# EAGLE design 14DoF LSM9DS1 ADXL375 (EAGLE 7.3.0)
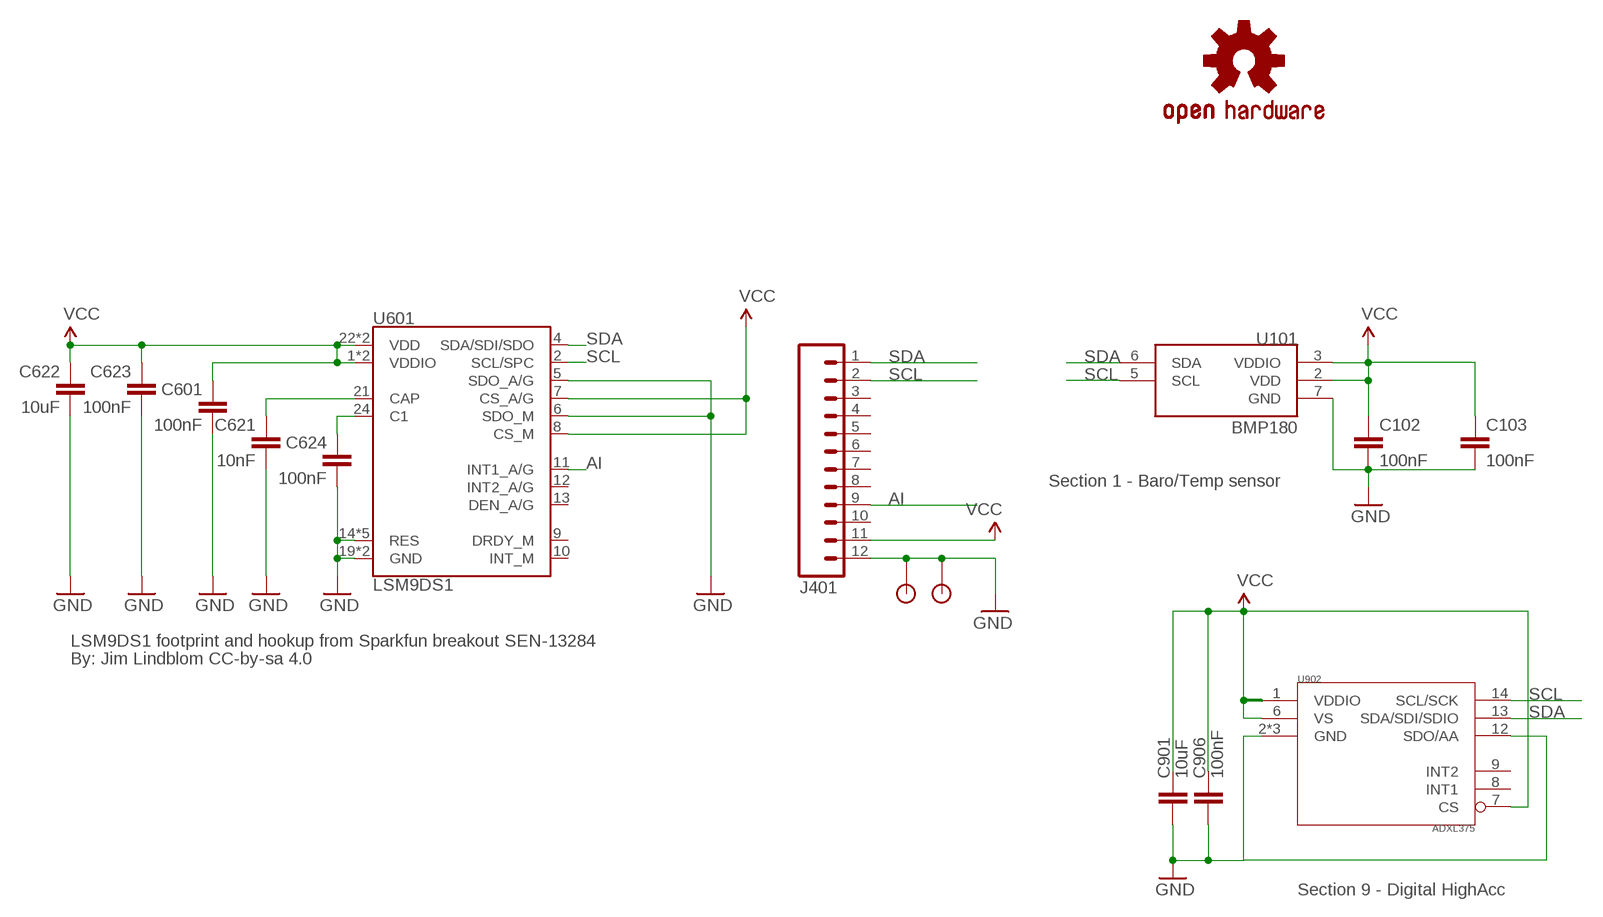
[diagram p0: schematic, sheet 1]

## Parts
C102  100nF  CAP0603-CAP  [0603-CAP]
C103  100nF  CAP0603-CAP  [0603-CAP]
C601  100nF  0.1UF-25V(+80/-20%)(0603)  [0603-CAP]
C621  10nF  10NF/10000PF-50V-10%(0603)  [0603-CAP]
C622  10uF  10UF-6.3V-20%(0603)  [0603-CAP]
C623  100nF  0.1UF-25V(+80/-20%)(0603)  [0603-CAP]
C624  100nF  0.1UF-25V(+80/-20%)(0603)  [0603-CAP]
C901  10uF  CAP0603-CAP  [0603-CAP]
C906  100nF  CAP0603-CAP  [0603-CAP]
J401  M12PTH  [1X12]
U101  BMP180  [BMP180]
U601  LSM9DS1  [LGA24-8X4]
U902  ADXL375  [ADXL375]
U$2  OSHW-LOGOS  [OSHW-LOGO-S]
U$4  STANDOFF  [STANDOFF]
U$5  STANDOFF  [STANDOFF]

## Nets
AI: J401.9 U601.11(INT1_A/G)
C1: C624.1 U601.24(C1)
CAP: C621.1 U601.21(CAP)
GND: C102.2 C103.2 C601.2 C621.2 C622.2 C623.2 C624.2 C901.2 C906.2 J401.12 U101.7(GND) U601.5(SDO_A/G) U601.6(SDO_M) U601.14(RES) U601.15(RES) U601.16(RES) U601.17(RES) U601.18(RES) U601.19(GND) U601.20(GND) U902.2(GND) U902.4(GND) U902.5(GND) U902.12(SDO/AA) U$4.P$1 U$5.P$1
SCL: J401.2 U101.5(SCL) U601.2(SCL/SPC) U902.14(SCL/SCK)
SDA: J401.1 U101.6(SDA) U601.4(SDA/SDI/SDO) U902.13(SDA/SDI/SDIO)
VCC [POWER]: C102.1 C103.1 C601.1 C622.1 C623.1 C901.1 C906.1 J401.11 U101.2(VDD) U101.3(VDDIO) U601.1(VDDIO) U601.3(VDDIO) U601.7(CS_A/G) U601.8(CS_M) U601.22(VDD) U601.23(VDD) U902.1(VDDIO) U902.6(VS)
Unconnected: J401.3 J401.4 J401.5 J401.6 J401.7 J401.8 J401.10 U601.9(DRDY_M) U601.10(INT_M) U601.12(INT2_A/G) U601.13(DEN_A/G) U902.7(CS) U902.8(INT1) U902.9(INT2)

## Notes on the sheet
- Section 1 - Baro/Temp sensor
- LSM9DS1 footprint and hookup from Sparkfun breakout SEN-13284
- By: Jim Lindblom CC-by-sa 4.0
- Section 9 - Digital HighAcc

## Library data of the parts
C102 C103 C906 = SparkFun:CAP: Capacitor Standard 0603 ceramic capacitor, and 0.1" leaded capacitor.; DIGIKEY: 445-1317-2-ND
C601 C623 C624 = SparkFun-Capacitors:0.1UF-25V(+80/-20%)(0603): CAP-00810 Ceramic Standard decoupling cap; PROD_ID: CAP-00810; VALUE: 0.1uF
C621 = SparkFun-Capacitors:10NF/10000PF-50V-10%(0603): CAP-00867; PROD_ID: CAP-00867
C622 = SparkFun-Capacitors:10UF-6.3V-20%(0603): CAP-11015; PROD_ID: CAP-11015
C901 = SparkFun:CAP: Capacitor Standard 0603 ceramic capacitor, and 0.1" leaded capacitor.; DIGIKEY: 445-7486-1-ND
J401 = SparkFun:M12: Header 12 Standard 12-pin 0.1" header. Use with straight break away headers (SKU : PRT-00116), right angle break away headers (PRT-00553), swiss pins (PRT-00743), machine pins (PRT-00117), and female headers (PRT-00115).; DIGIKEY: $NOPART
U101 = KwanSystems:BMP180; DIGIKEY: 828-1027-1-ND
U601 = LSM9DS1_temp:LSM9DS1: LSM9DS1 3D accelerometer, gyroscope & magnetometer The LSM9DS1 is a system-in-package featuring a 3D digital linear acceleration sensor, a 3D digital angular rate sensor, and a 3D digital magnetic sensor. The LSM9DS1 has a linear acceleration full scale of ±2g/±4g/±8/±16 g, a magnetic field full scale of ±4/±8/±12/±16 gauss and an angular rate of ±245/±500/±2000 dps. The LSM9DS1 includes an I2 C serial bus interface supporting standard and fast mode (100 kHz and 400 kHz) and an SPI serial standard interface. Magnetic, accelerometer and gyroscope sensing can be enabled or set in power-down mode separately for smart power management. The LSM9DS1 is available in a plastic land grid array package (LGA) and it is guaranteed to operate over an extended temperature range from -40 °C to +85 °C.; PROD_ID: IC-12536
U902 = KwanSystems:ADXL375
U$2 = SparkFun:OSHW-LOGO: Open Source Hardware Logo This logo indicates the piece of hardware it is found on incorporates a OSHW license and/or adheres to the definition of open source hardware found here: http://freedomdefined.org/OSHW; DIGIKEY: $NOPART
U$4 U$5 = KwanSystems:STANDOFF

## Net classes
0 default: width 0.152 mm, drill 0.33 mm, clearance 0.152 mm
1 POWER: width 0.152 mm, drill 0.33 mm, clearance 0.152 mm
2 hv: width 0.152 mm, drill 0.33 mm, clearance 0.152 mm

## Board
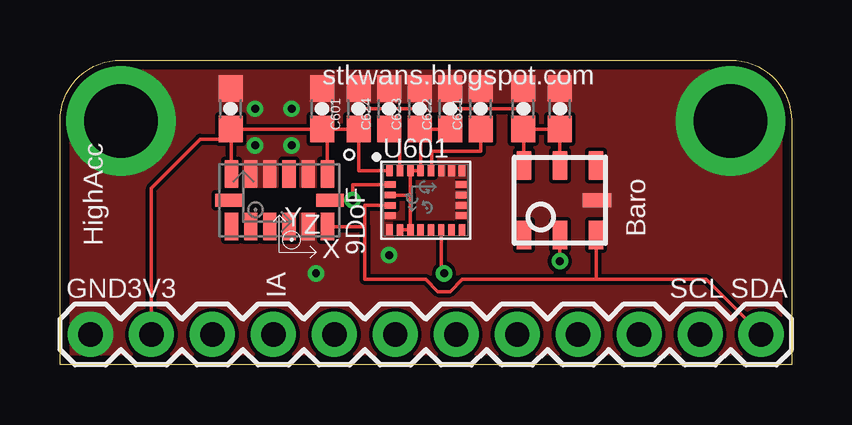
[diagram p1: board, top side]
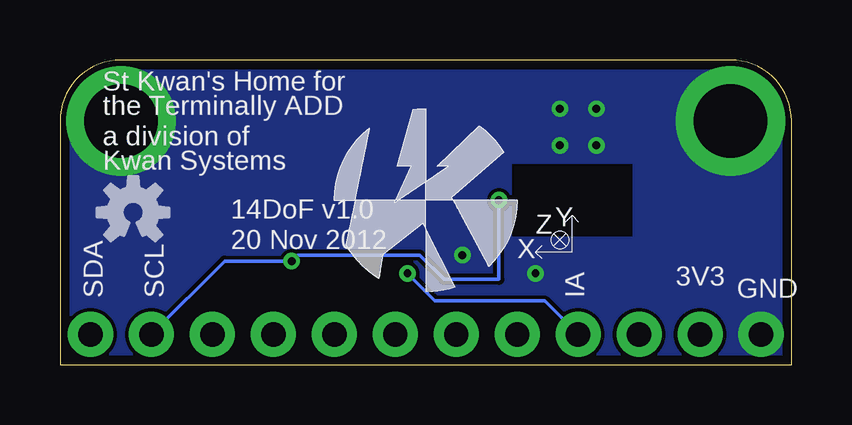
[diagram p2: board, bottom side, seen from below]

Size 30.48 x 12.7 mm. Coordinates in mm from the lower left corner, seen from the top.
Outline: 0,0 0,10.16 arc-90 2.54,12.7 27.94,12.7 arc-90 30.48,10.16 30.48,0 0,0
Copper layers (1*16): Top 0.0356mm / dielectric 1.5011mm / Bottom 0.0356mm
Design rules "default": minimum track width 6mil, minimum drill 13mil, track to track 6mil, track to pad 6mil, pad to pad 6mil, via to via 6mil, smd to smd 6mil, copper to edge 15mil, drill to drill 6mil, minimum pad ring 7mil, minimum via ring 7mil, stop-mask expansion 4mil, vias tented up to drill 14mil, thermal gap 10mil
vRestrict: area 0.8,2.8 to 1.8,4.8; area 3.3,2.8 to 4.3,4.8; area 5.8,2.8 to 6.9,4.8; area 8.4,2.8 to 9.4,3.8; area 10.9,2.8 to 11.7,5.3; area 12.7,2.8 to 15.2,3.6; area 13.5,3.6 to 14.2,5.3; area 15.5,2.8 to 18,3.6; area 18.5,2.8 to 19.6,3.8; area 20.6,2.8 to 22.6,3.6; area 21.1,3.6 to 21.8,4.8; area 23.6,2.8 to 24.4,3.8; 19 more areas

### Footprints (pad centres in the part's own frame; a part is rotated, then mirrored left to right if it is on the bottom)
0603-CAP = smd 1.1 x 1: 1 -0.85,0; 2 0.85,0
1X12 = drill 1.016 pad 1.88: 1 0,0; 2 2.54,0; 3 5.08,0; 4 7.62,0; 5 10.16,0; 6 12.7,0; 7 15.24,0; 8 17.78,0; 9 20.32,0; 10 22.86,0; 11 25.4,0; 12 27.94,0
BMP180 = smd 0.6 x 1.2: 1 1.5,1.45; 2 0,1.45; 3 -1.5,1.45; 4 -1.5,-1.45; 5 0,-1.45; 6 1.5,-1.45 | smd 1.2 x 0.6: 7 1.55,0
LGA24-8X4 = smd 0.27 x 0.45: 1 -1.505,1.225; 6 -1.505,-1.225; 7 -1.075,-1.225; 8 -0.645,-1.225; 9 -0.215,-1.225; 10 0.215,-1.225; 11 0.645,-1.225; 12 1.075,-1.225; 13 1.505,-1.225; 18 1.505,1.225; 19 1.075,1.225; 20 0.645,1.225; 21 0.215,1.225; 22 -0.215,1.225; 23 -0.645,1.225; 24 -1.075,1.225 | smd 0.45 x 0.27: 2 -1.475,0.645; 3 -1.475,0.215; 4 -1.475,-0.215; 5 -1.475,-0.645; 14 1.475,-0.645; 15 1.475,-0.215; 16 1.475,0.215; 17 1.475,0.645
ADXL375 = smd 0.55 x 1.145: 1 2,1.097; 2 1.2,1.097; 3 0.4,1.097; 4 -0.4,1.097; 5 -1.2,1.097; 6 -2,1.097; 8 -2,-1.097; 9 -1.2,-1.097; 10 -0.4,-1.097; 11 0.4,-1.097; 12 1.2,-1.097; 13 2,-1.097 | smd 1.145 x 0.55: 7 -2.098,0; 14 2.098,0
STANDOFF = drill 3.048 pad 4.572: P$1 0,0

### Placement (x,y rotation side)
C102  20.83,10.67 90 top
C103  19.3,10.67 90 top
C601  12.45,10.67 90 top
C621  17.53,10.67 90 top
C622  16.26,10.67 90 top
C623  14.99,10.67 90 top
C624  13.72,10.67 90 top
C901  10.92,10.67 90 top
C906  7.11,10.67 90 top
J401  29.21,1.27 180 top
U101  20.83,6.86 0 top
U601  15.24,6.86 0 top
U902  9.14,6.86 0 top
U$1  [KWAN_ACC]  15.24,6.86 0 bottom
U$2  27.43,6.35 0 bottom
U$3  [AXES_SM]  9.14,4.7 0 top
U$4  2.54,10.16 0 top
U$5  27.94,10.16 0 top

### Tracks (layer width: path | path; a pad name or v marks a point on that pad's centre or on a via)
AI  (via drill 0.33)
  Top 0.152: U601.11 15.88,3.93 v16,3.81
  Bottom 0.152: J401.9 10.29,2.67 14.86,2.67 v16,3.81
C1
  Top 0.152: C624.1 14.16,9.37 U601.24
CAP
  Top 0.152: U601.21 15.49,8.13 15.49,8.89 17.53,8.89 C621.1
GND  (via drill 0.33)
  other vias: 13.72,4.57 10.67,3.81 8.13,9.14 8.13,10.67 9.65,9.14 9.65,10.67
  pour Top (no thermals): 0,0 0,10.16 arc-90 2.54,12.7 27.94,12.7 arc-90 30.48,10.16 30.48,0
  pour Bottom (no thermals): 0,0 0,10.16 arc-90 2.54,12.7 27.94,12.7 arc-90 30.48,10.16 30.48,0
SCL  (via drill 0.33)
  Top 0.152: U902.14 v12.19,6.86 12.19,7.5 U601.2 | v20.83,4.32 U101.5
  Bottom 0.152: J401.2 23.62,4.32 v20.83,4.32 20.57,4.57 15.49,4.57 14.48,3.56 12.19,3.56 v12.19,6.86
SDA
  Top 0.152: U902.13 12.7,5.76 | 12.7,5.76 12.7,6.64 U601.4 | 12.7,5.76 12.7,3.56 15.24,3.56 15.75,3.05 16.26,3.05 16.76,3.56 22.35,3.56 | 22.35,3.56 22.35,5.41 U101.6 | 22.35,3.56 26.92,3.56 J401.1
VCC
  Top 0.152: C623.1 C622.1 16.26,10.67 19.3,10.67 C103.1 | C623.1 15.03,9.44 U601.22 U601.23 14.6,7.07 | C601.1 12.45,8.08 U601.1 | U902.6 7.14,9.82 | 7.14,9.82 C906.1 6.69,9.4 5.84,9.4 3.81,7.37 J401.11 | C901.1 arc-90 11.14,9.6 U902.1 | 7.14,9.82 C901.1 | C601.1 C901.1 | C601.1 12.45,10.67 14.99,10.67 C623.1 | C103.1 19.33,9.82 U101.3 | C103.1 C102.1 U101.2 | U601.7 U601.8 14.6,7.07 | U601.3 14.6,7.07

### Text on the board
tPlace: stkwans.blogspot.com | HighAcc | 9DoF | Baro | GND | 3V3 | IA | SCL | SDA
bPlace: St Kwan's Home for | the Terminally ADD | a division of | Kwan Systems | 14DoF v1.0 | 20 Nov 2012 | GND | 3V3 | IA | SCL | SDA